# Altium schematic sheet PAH_Deployments.SchDoc
size 482 x 350 mm; Origin: Eagle
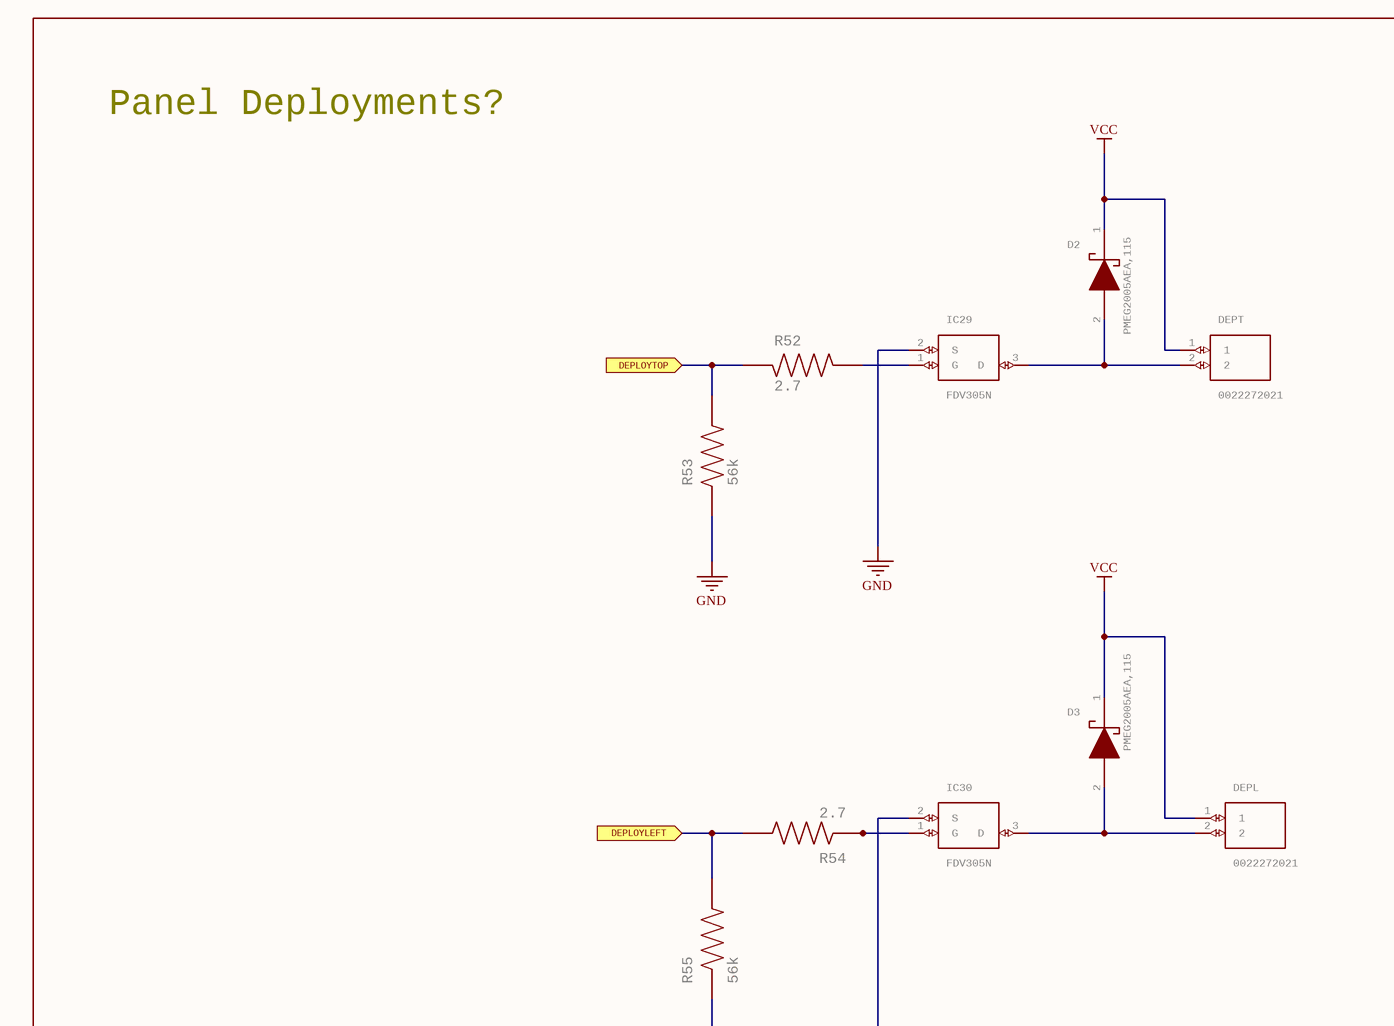
[diagram p0: PAH_Deployments.SchDoc, top left]
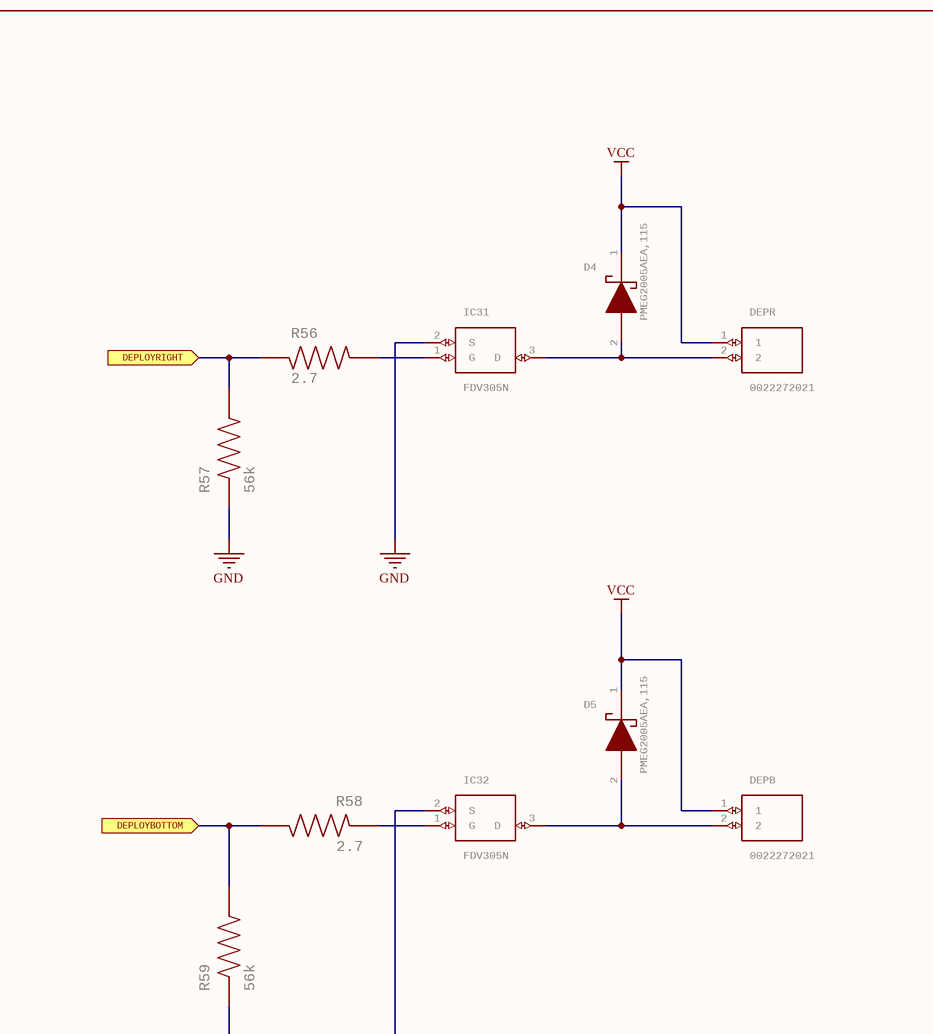
[diagram p1: PAH_Deployments.SchDoc, top right]
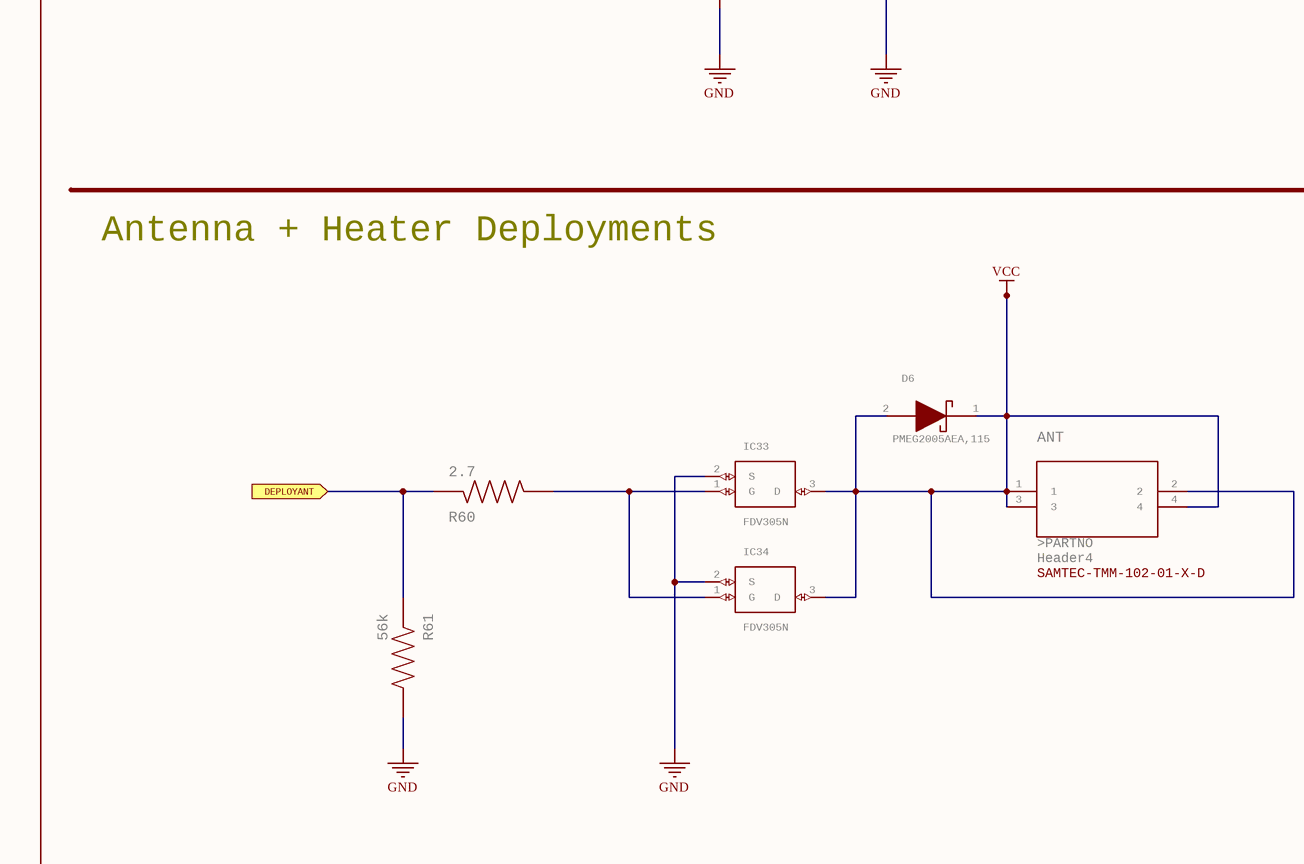
[diagram p2: PAH_Deployments.SchDoc, bottom left]
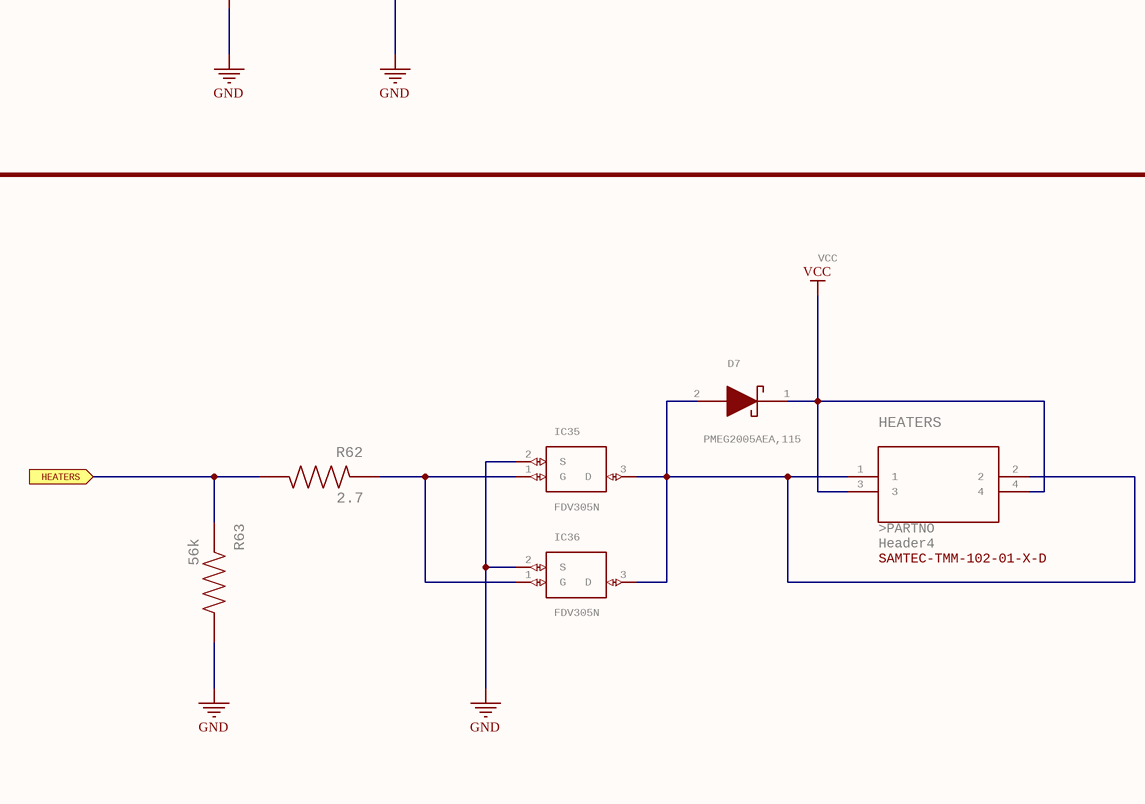
[diagram p3: PAH_Deployments.SchDoc, bottom right]

## Parts
ANT  Header4  PARTNO: >PARTNO  [SAMTEC-TMM-102-01-X-D]
D2  PMEG2005AEA,115  [SOD2512X110N]
D3  PMEG2005AEA,115  [SOD2512X110N]
D4  PMEG2005AEA,115  [SOD2512X110N]
D5  PMEG2005AEA,115  [SOD2512X110N]
D6  PMEG2005AEA,115  [SOD2512X110N]
D7  PMEG2005AEA,115  [SOD2512X110N]
DEPB  0022272021  [SHDR2W64P0X254_1X2_508X580X117]
DEPL  0022272021  [SHDR2W64P0X254_1X2_508X580X117]
DEPR  0022272021  [SHDR2W64P0X254_1X2_508X580X117]
DEPT  0022272021  [SHDR2W64P0X254_1X2_508X580X117]
HEATERS  Header4  PARTNO: >PARTNO  [SAMTEC-TMM-102-01-X-D]
IC29  FDV305N  [SOT95P240X120-3N]
IC30  FDV305N  [SOT95P240X120-3N]
IC31  FDV305N  [SOT95P240X120-3N]
IC32  FDV305N  [SOT95P240X120-3N]
IC33  FDV305N  [SOT95P240X120-3N]
IC34  FDV305N  [SOT95P240X120-3N]
IC35  FDV305N  [SOT95P240X120-3N]
IC36  FDV305N  [SOT95P240X120-3N]
R52  2.7  [RESC1608X55N]
R53  56k  [RESC1608X55N]
R54  2.7  [RESC1608X55N]
R55  56k  [RESC1608X55N]
R56  2.7  [RESC1608X55N]
R57  56k  [RESC1608X55N]
R58  2.7  [RESC1608X55N]
R59  56k  [RESC1608X55N]
R60  2.7  [RESC1608X55N]
R61  56k  [RESC1608X55N]
R62  2.7  [RESC1608X55N]
R63  56k  [RESC1608X55N]

## Ports
DEPLOYANT (in), DEPLOYBOTTOM (in), DEPLOYLEFT (in), DEPLOYRIGHT (in), DEPLOYTOP (in), HEATERS (in)

## Nets
GND: IC29.2(S) IC30.2(S) IC31.2(S) IC32.2(S) IC33.2(S) IC34.2(S) IC35.2(S) IC36.2(S) R53.1 R55.1 R57.1 R59.1 R61.2 R63.2
VCC: ANT.1 ANT.2 ANT.3 ANT.4 D2.1(K) D3.1(K) D4.1(K) D5.1(K) D6.1(K) D6.2(A) D7.1(K) DEPB.1 DEPL.1 DEPR.1 DEPT.1 HEATERS.3 HEATERS.4 IC33.3(D) IC34.3(D)
DEPLOYANT: R60.1 R61.1 ; port DEPLOYANT
DEPLOYBOTTOM: R58.2 R59.2 ; port DEPLOYBOTTOM
DEPLOYLEFT: R54.2 R55.2 ; port DEPLOYLEFT
DEPLOYRIGHT: R56.2 R57.2 ; port DEPLOYRIGHT
DEPLOYTOP: R52.2 R53.2 ; port DEPLOYTOP
HEATERS: R62.2 R63.1 ; port HEATERS
NetD2_2: D2.2(A) DEPT.2 IC29.3(D)
NetD3_2: D3.2(A) DEPL.2 IC30.3(D)
NetD4_2: D4.2(A) DEPR.2 IC31.3(D)
NetD5_2: D5.2(A) DEPB.2 IC32.3(D)
NetD7_2: D7.2(A) HEATERS.1 HEATERS.2 IC35.3(D) IC36.3(D)
NetIC29_1: IC29.1(G) R52.1
NetIC30_1: IC30.1(G) R54.1
NetIC31_1: IC31.1(G) R56.1
NetIC32_1: IC32.1(G) R58.1
NetIC33_1: IC33.1(G) IC34.1(G) R60.2
NetIC35_1: IC35.1(G) IC36.1(G) R62.1

## Notes on the sheet
- Panel Deployments?
- Antenna + Heater Deployments
- VCC

## Library data of the parts
ANT HEATERS = SAMTEC-TMM-102-01-X-DJ: Check prices; GateName_1: A; SymbolName_1: SAMTEC-TMM-102-01-X-DA; DeviceName: J; MF: Samtec Inc.; MP: TMM-102-01-T-D; LibraryName: 4 pin header replace; DeviceSetName: SAMTEC-TMM-102-01-X-D; SAMTEC-TMM-102-01-X-D: SAMTEC-TMM-102-01-X-D; AVAILABILITY: In Stock; PACKAGE: None; PRICE: None; PURCHASE-URL: https://pricing.snapeda.com/search/part/TMM-102-01-T-D/?ref=eda
D2-D7 = PMEG2005AEA,115: NXP PMEG2005AEA,115, SMT Schottky Diode, 20V 500mA, 2-Pin SOD-323   Source:  Datasheet; MANUFACTURER_NAME: Nexperia; GateName_1: G$1; SymbolName_1: PMEG2005AEA,115; LibraryName: PMEG2005AEA_115; DeviceSetName: PMEG2005AEA,115; ARROW_PART_NUMBER: PMEG2005AEA,115; ARROW_PRICE-STOCK: https://www.arrow.com/en/products/pmeg2005aea115/nexperia; HEIGHT: 1.1mm; MANUFACTURER_PART_NUMBER: PMEG2005AEA,115; MOUSER_PART_NUMBER: 771-PMEG2005AEA115; MOUSER_PRICE-STOCK: https://www.mouser.co.uk/ProductDetail/Nexperia/PMEG2005AEA115?qs=LOCUfHb8d9v8DU9iEgA%252BhA%3D%3D
DEPB DEPL DEPR DEPT = 0022272021: Conn Wire to Board HDR 2 POS 2.54mm Solder ST Thru-Hole KK Bag   Source:  Datasheet; MANUFACTURER_NAME: Molex; GateName_1: G$1; SymbolName_1: 0022272021; LibraryName: header 2; DeviceSetName: 0022272021; ARROW_PART_NUMBER: 0022272021; ARROW_PRICE-STOCK: https://www.arrow.com/en/products/0022272021/molex; HEIGHT: 11.7mm; MANUFACTURER_PART_NUMBER: 0022272021; MOUSER_PART_NUMBER: N/A; MOUSER_PRICE-STOCK: https://www.mouser.co.uk/ProductDetail/Molex/0022272021?qs=PBcRNPEHKsoTuJ7eDXMaUA%3D%3D
IC29-IC36 = FDV305N: FDV305N, N-channel MOSFET Transistor 0.9 A 20 V, 3-Pin SOT-23   Source:  Datasheet; MANUFACTURER_NAME: ON Semiconductor; GateName_1: G$1; SymbolName_1: FDV305N; LibraryName: FDV305N; DeviceSetName: FDV305N; ARROW_PART_NUMBER: FDV305N; ARROW_PRICE-STOCK: https://www.arrow.com/en/products/fdv305n/on-semiconductor; HEIGHT: 1.2mm; MANUFACTURER_PART_NUMBER: FDV305N; MOUSER_PART_NUMBER: 512-FDV305N; MOUSER_PRICE-STOCK: https://www.mouser.co.uk/ProductDetail/ON-Semiconductor-Fairchild/FDV305N?qs=mdiO5HdF0KjwjAZb7xdQ1g%3D%3D
R52 R54 R56 R58 R60 R62 = RL0816S-2R7-F: GateName_1: G$1; MF: Susumu; SymbolName_1: RL0816S-2R7-F; LibraryName: Res1-2.7; DeviceSetName: RL0816S-2R7-F; DIGI-KEY_PART_NUMBER: DIGI-KEY_PART_NUMBER; MP: RL0816S-2R7-F; PACKAGE: 1608 Susumu
R53 R55 R57 R59 R61 R63 = ERJ-PB3D5602V: RES SMD 56K OHM 0.5% 1/5W 0603; GateName_1: G$1; MF: Panasonic; SymbolName_1: ERJ-PB3D5602V; LibraryName: Res1 56k; DeviceSetName: ERJ-PB3D5602V; DIGI-KEY_PART_NUMBER: DIGI-KEY_PART_NUMBER; MP: ERJ-PB3D5602V; PACKAGE: 1608 Panasonic Electronic Components